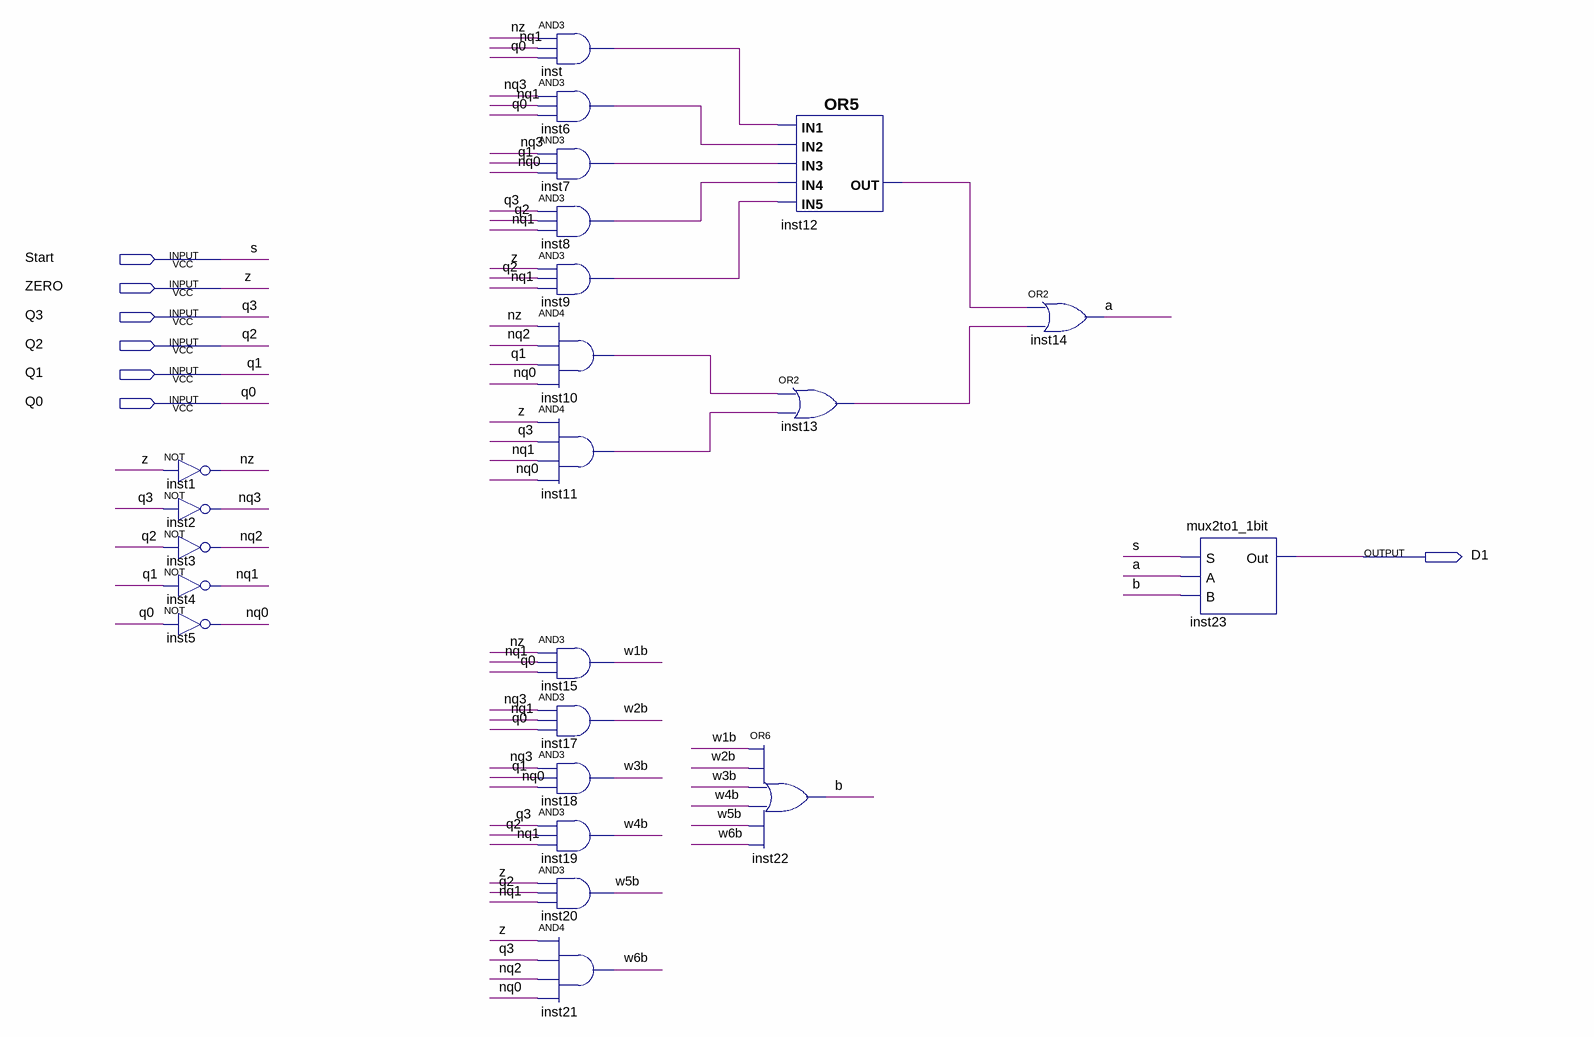
[diagram p0: schematic sheet]
// Quartus schematic D1.bdf as structural Verilog: 23 symbols, 7 pins
module D1 (
  input  Start,
  input  ZERO,
  input  Q3,
  input  Q2,
  input  Q1,
  input  Q0,
  output D1
);

  wire a, b, inst6_out, inst7_out, inst8_out, inst9_out, inst10_out, inst11_out, inst12_out, inst13_out,
       inst_out, nq0, nq1, nq2, nq3, nz, w1b, w2b, w3b, w4b, w5b, w6b;

  not inst1 (nz, ZERO);
  not inst2 (nq3, Q3);
  not inst3 (nq2, Q2);
  not inst4 (nq1, Q1);
  not inst5 (nq0, Q0);
  and inst (inst_out, nz, nq1, Q0);
  and inst6 (inst6_out, nq3, nq1, Q0);
  and inst7 (inst7_out, nq3, Q1, nq0);
  and inst8 (inst8_out, Q3, Q2, nq1);
  and inst9 (inst9_out, ZERO, Q2, nq1);
  and inst10 (inst10_out, nz, nq2, Q1, nq0);
  and inst11 (inst11_out, ZERO, Q3, nq1, nq0);
  and inst15 (w1b, nz, nq1, Q0);
  and inst17 (w2b, nq3, nq1, Q0);
  and inst18 (w3b, nq3, Q1, nq0);
  and inst19 (w4b, Q3, Q2, nq1);
  and inst20 (w5b, ZERO, Q2, nq1);
  and inst21 (w6b, ZERO, Q3, nq2, nq0);
  or inst12 (inst12_out, inst_out, inst6_out, inst7_out, inst8_out, inst9_out);
  or inst13 (inst13_out, inst10_out, inst11_out);
  or inst22 (b, w1b, w2b, w3b, w4b, w5b, w6b);
  or inst14 (a, inst12_out, inst13_out);
  mux2to1_1bit inst23 (.S(Start), .A(a), .B(b), .Out(D1));

  // Other names for the same wires on the sheet: s = Start; z = ZERO
endmodule
